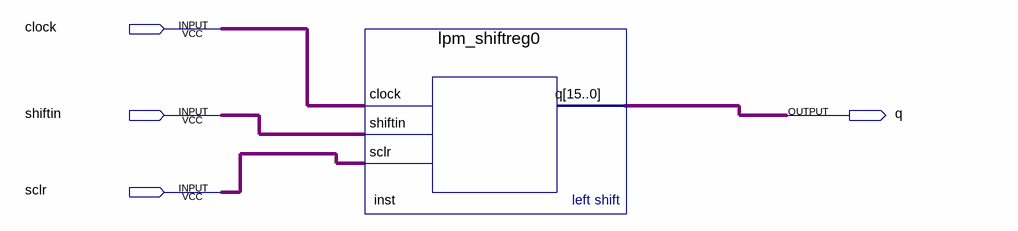
[diagram p0: schematic sheet]
// Quartus schematic lpm_shiftreg0.bdf as structural Verilog: 1 symbols, 4 pins
module lpm_shiftreg0 (
  input  clock,
  input  shiftin,
  input  sclr,
  output q
);

  wire [15:0] inst_q;

  lpm_shiftreg0 inst (.clock(clock), .shiftin(shiftin), .sclr(sclr), .q(inst_q));
endmodule
